# EasyEDA Pro project f1-control.eprj

# Schematic Schematic1
Create Date: 2024-01-17; Page Name: P1; Project Name: f1-control; Schematic Name: Schematic1; Update Date: 2024-01-29; Company: 嘉立创EDA; Page Size: A4; Version: V1.0
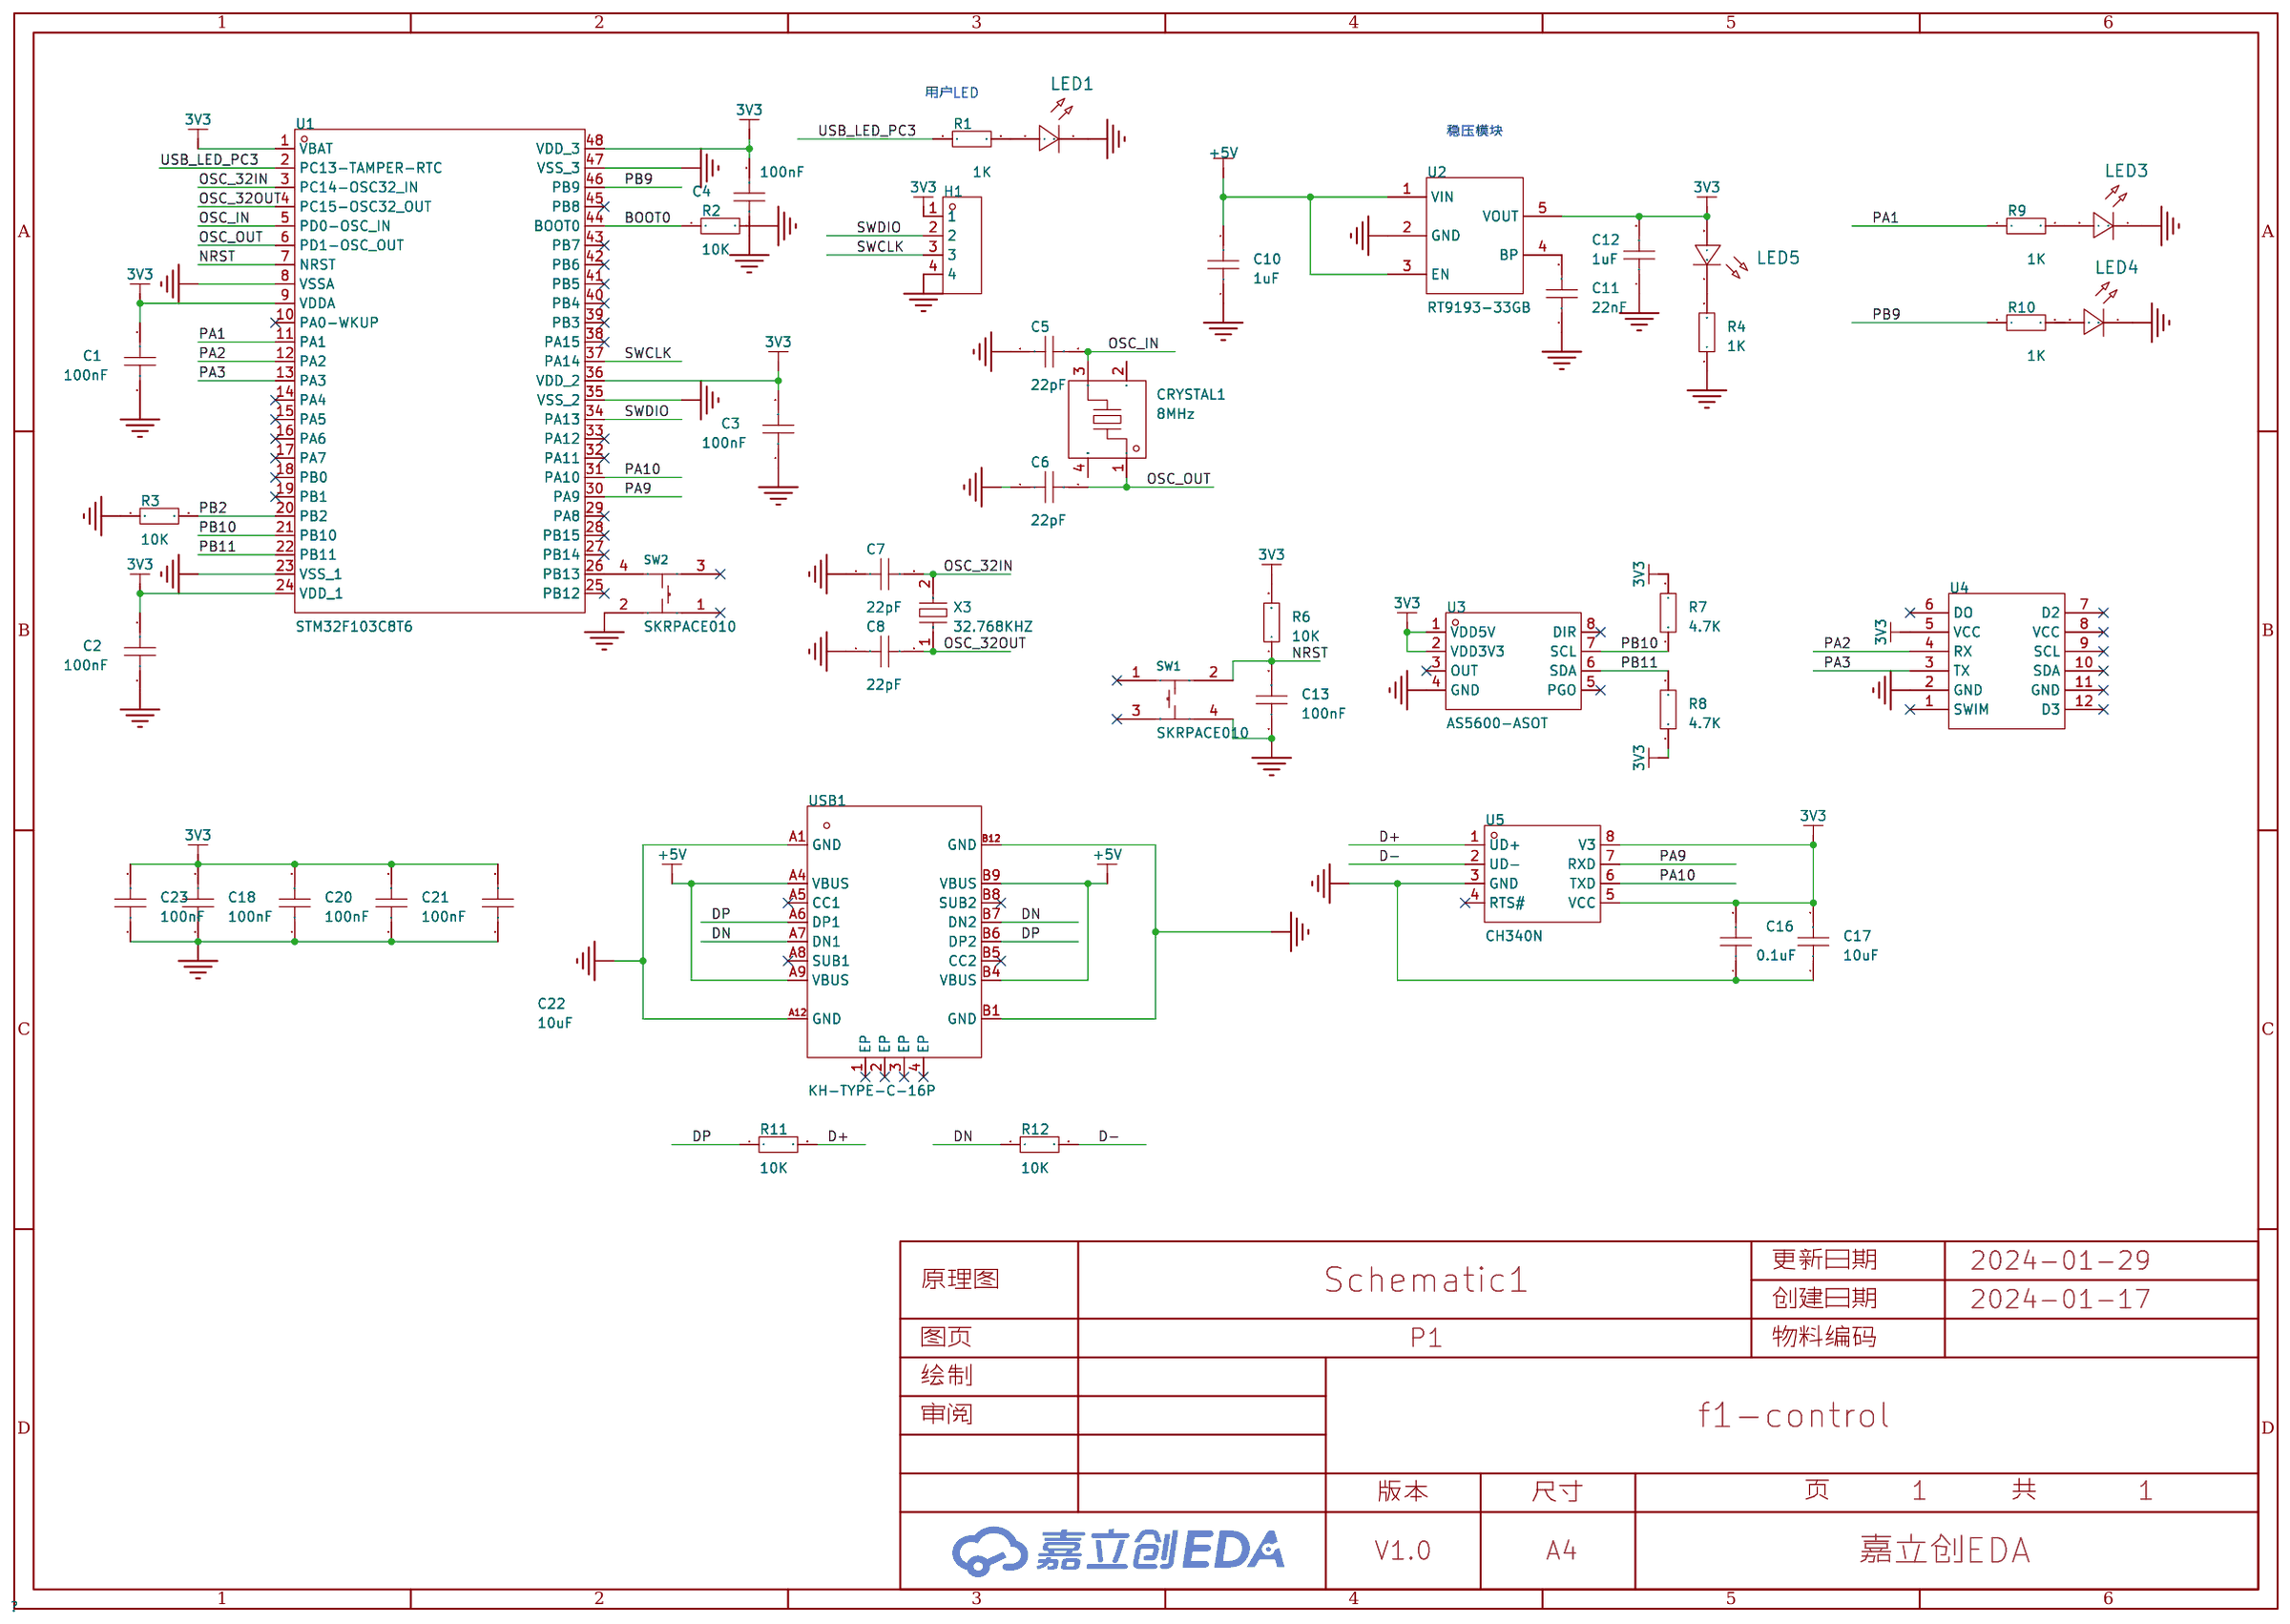
[diagram p0: schematic sheet]

## Parts
C1  100nF  [C0603]
C2  100nF  [C0603]
C3  100nF  [C0603]
C4  100nF  [C0603]
C5  22pF  [C0603]
C6  22pF  [C0603]
C7  22pF  [C0603]
C8  22pF  [C0603]
C10  1uF  [C0603]
C11  22nF  [C0603]
C12  1uF  [C0603]
C13  100nF  [C0603]
C16  0.1uF  [C0603]
C17  10uF  [C0603]
C18  100nF  [C0603]
C20  100nF  [C0603]
C21  100nF  [C0603]
C22  10uF  [C0603]
C23  100nF  [C0603]
CRYSTAL1  8MHz  [CRYSTAL-SMD_4P-L3.2-W2.5-BL_SIT8008BI]
H1  -  [HDR-TH_4P-P2.54-V-F]
LED1  -  [LED_0603]
LED3  -  [LED_0603]
LED4  -  [LED_0603]
LED5  -  [LED_0603]
R1  1K  [R0603]
R2  10K  [R0603]
R3  10K  [R0603]
R4  1K  [R0603]
R6  10K  [R0603]
R7  4.7K  [R0603]
R8  4.7K  [R0603]
R9  1K  [R0603]
R10  1K  [R0603]
R11  10K  [R0603]
R12  10K  [R0603]
SW1  SKRPACE010  [KEY-SMD_4P-L4.2-W3.2-P2.20-LS4.6]
SW2  SKRPACE010  [KEY-SMD_4P-L4.2-W3.2-P2.20-LS4.6]
U1  STM32F103C8T6  [LQFP-48_L7.0-W7.0-P0.50-LS9.0-BL]
U2  RT9193-33GB  [SOT-23-5_L3.0-W1.7-P0.95-LS2.8-BL]
U3  AS5600-ASOT  [SOIC-8_L5.0-W4.0-P1.27-LS6.0-BL]
U4  -  [WT901BC_TYL]
U5  CH340N  [SOP-8_L5.0-W4.0-P1.27-LS6.0-BL]
USB1  KH-TYPE-C-16P  [USB-C-SMD_KH-TYPE-C-16P]
X3  32.768KHZ  [CRYSTAL-SMD_L3.2-W1.5-1]

## Library data of the parts
C1-C8 C10-C13 C16-C18 C20-C23 = CAP_0603: Supplier Footprint: 0603
CRYSTAL1 = CF4008M00012001: 晶振类型:贴片晶振;频率:8MHz;常温频差:±10ppm;外接负载电容:12pF;频率稳定度(全温):±30ppm;; LCSC Part Name: 8MHz ±10ppm 12pF; Supplier Part: C7294546; Manufacturer: HUAXIN(华昕); Supplier Footprint: SMD-3225-4P; JLCPCB Part Class: 扩展库; Datasheet: https://atta.szlcsc.com/upload/public/pdf/source/20230614/403FD538918E19EFAFACD07D4A487DFF.pdf; Supplier: LCSC; Crystal Type: 贴片晶振; Normal temperature Frequency Tolerance: ±10ppm; External load capacitor: 12pF; Frequency Stability(Full temperature range): ±30ppm; Equivalent Series Resistance (ESR): 40Ω; Operating Temperature: -40℃~+85℃
H1 = HDR-F_2.54_1x4P: Supplier Part: C2718488; Supplier Footprint: 插件
LED1 LED3-LED5 = LED_0603-R: Supplier Footprint: 0603
R1-R4 R6-R12 = Res_0603: Supplier Footprint: 0603
SW1 SW2 = SKRPACE010: 触点电流:50mA;额定电压(DC):16V;电路结构:单刀单掷;安装方式:立贴;带灯:-;机械寿命:-;; LCSC Part Name: 4.2*3.2*2.5mm 立贴 轻触开关; Supplier Part: C139797; Manufacturer: ALPSALPINE(阿尔卑斯阿尔派); Supplier Footprint: SMD; JLCPCB Part Class: 扩展库; Datasheet: https://atta.szlcsc.com/upload/public/pdf/source/20171113/C139797_15105612676371115729.pdf; Supplier: LCSC; Contact Current: 50mA; Voltage Rating (DC): 16V; Circuit: 单刀单掷; Mounting Style: 立贴; Actuator Style: 椭圆形按钮; Switch Length: 4.2mm; Switch Width: 3.2mm; Switch Height: 2.5mm
U1 = STM32F103C8T6: CPU内核:ARM Cortex-M3;CPU最大主频:72MHz;工作电压范围:2V~3.6V;程序存储容量:64KB;程序存储器类型:FLASH;RAM总容量:20KB;GPIO端口数量:37;; LCSC Part Name: STM32F103C8T6 MSL=3; Supplier Part: C8734; Manufacturer: ST(意法半导体); Supplier Footprint: LQFP-48(7x7); JLCPCB Part Class: 扩展库; Datasheet: https://atta.szlcsc.com/upload/public/pdf/source/20220812/8363ACEC51AD55ECEB84799464F7CB85.pdf; Supplier: LCSC; CPU Core: ARM Cortex-M3; CPU Maximum Speed: 72MHz; Operating Voltage Range: 2V~3.6V; Program Storage Size: 64KB; Program Memory Type: FLASH; RAM Size: 20KB; GPIO Ports Number: 37; ADC (Bit): 12bit; Universal Serial Bus: 有; Peripheral/Function: 看门狗；DMA；看门狗；片载温度传感器; Watchdog: 有; Infrared Data Association: 有; Low-Voltage Detect: 有; Direct Memory Access: 有; Internal Oscillator: 有; Operating Temperature Range: -40℃~+85℃
U2 = RT9193-33GB: 输出类型:固定;最大输入电压:5.5V;输出电压:3.3V;最大输出电流:300mA;电源纹波抑制比(PSRR):70dB;输出极性:正极;; LCSC Part Name: 输入5.5V 输出3.3V 300mA; Supplier Part: C15651; Manufacturer: RICHTEK(立锜); Supplier Footprint: SOT-23-5; JLCPCB Part Class: 扩展库; Datasheet: https://atta.szlcsc.com/upload/public/pdf/source/20130730/1457706628575.pdf; Supplier: LCSC; Output Type: 固定; Maximum Input Voltage: 5.5V; Output Voltage: 3.3V; MAX Output Current: 300mA; Power Supply Rejection Ratio (PSRR): 70dB; Dropout Voltage: 300mV@(300mA); standby current: 130uA; Operating Temperature: -40℃~+125℃; Output Polarity: 正极; Number of Outputs: 1
U3 = AS5600-ASOT: Supplier Part: C499458; Manufacturer: ams(艾迈斯半导体); Supplier Footprint: SOIC-8; JLCPCB Part Class: 扩展库; Datasheet: https://atta.szlcsc.com/upload/public/pdf/source/20200324/C499458_E1461AFB0CE1042DE5756821C534625C.pdf; Supplier: LCSC
U4 = WT901BC_TYL
U5 = CH340N_C506813: 应用功能:-;接口协议:-;; LCSC Part Name: USB转串口芯片 CH340; Supplier Part: C506813; Manufacturer: WCH(南京沁恒); Supplier Footprint: SOP-8; JLCPCB Part Class: 扩展库; Datasheet: https://atta.szlcsc.com/upload/public/pdf/source/20200819/C84681_ADBED554CE321879DBD6B1D06488689C.pdf; Supplier: LCSC
USB1 = KH-TYPE-C-16P: 连接器类型:Type-C;标准:-;公母:母;端口数量:1;触点数量:16P;安装方式:卧贴;额定电流 - 电源:3A;工作温度范围:-40℃~+85℃;; LCSC Part Name: Type-C 母 卧贴; Supplier Part: C709357; Manufacturer: kinghelm(金航标); Supplier Footprint: SMD; JLCPCB Part Class: 扩展库; Datasheet: https://atta.szlcsc.com/upload/public/pdf/source/20200911/C709357_AA8DCEB38BB20E3035A7ED7AE7667837.pdf; Supplier: LCSC; Connector Type: Type-C; Gender: 母; Number of Ports: 1; Number of Contacts: 16P; Mounting Style: 卧贴; Current Rating - Power (Max): 3A; Operating Temperature Range: -40℃~+85℃
X3 = 32.768KHZ: Supplier Part: C9900023773; Supplier Footprint: FC-135; JLCPCB Part Class: 扩展库; Supplier: LCSC

## Nets
3V3: C1.2 C2.2 C3.2 C4.2 C12.2 C16.2 C17.2 C18.2 C20.2 C21.2 C22.2 C23.2 H1.1 LED5.2(A) R6.2 R7.2 R8.2 U1.1(VBAT) U1.9(VDDA) U1.24(VDD_1) U1.36(VDD_2) U1.48(VDD_3) U2.5(VOUT) U3.1(VDD5V) U3.2(VDD3V3) U4.5(VCC) U5.5(VCC) U5.8(V3)
+5V: C10.2 U2.1(VIN) U2.3(EN) USB1.A4(VBUS) USB1.A9(VBUS) USB1.B4(VBUS) USB1.B9(VBUS)
GND: C1.1 C2.1 C3.1 C4.1 C5.1 C6.1 C7.1 C8.1 C10.1 C11.1 C12.1 C13.1 C16.1 C17.1 C18.1 C20.1 C21.1 C22.1 C23.1 H1.4 LED1.1(C) LED3.1(C) LED4.1(C) R2.2 R3.1 R4.1 SW1.4 SW2.2 U1.8(VSSA) U1.23(VSS_1) U1.35(VSS_2) U1.47(VSS_3) U2.2(GND) U3.4(GND) U4.2(GND) U5.3(GND) USB1.A1(GND) USB1.A12(GND) USB1.B1(GND) USB1.B12(GND)
BOOT0: R2.1 U1.44(BOOT0)
D+: R11.2 U5.1(UD+)
D-: R12.2 U5.2(UD-)
DN: R12.1 USB1.A7(DN1) USB1.B7(DN2)
DP: R11.1 USB1.A6(DP1) USB1.B6(DP2)
NRST: C13.2 R6.1 SW1.2 U1.7(NRST)
OSC_32IN: C7.2 U1.3(PC14-OSC32_IN) X3.2
OSC_32OUT: C8.2 U1.4(PC15-OSC32_OUT) X3.1
OSC_IN: C5.2 CRYSTAL1.3 U1.5(PD0-OSC_IN)
OSC_OUT: C6.2 CRYSTAL1.1 U1.6(PD1-OSC_OUT)
PA1: R9.1 U1.11(PA1)
PA2: U1.12(PA2) U4.4(RX)
PA3: U1.13(PA3) U4.3(TX)
PA9: U1.30(PA9) U5.7(RXD)
PA10: U1.31(PA10) U5.6(TXD)
PB2: R3.2 U1.20(PB2)
PB9: R10.1 U1.46(PB9)
PB10: R7.1 U1.21(PB10) U3.7(SCL)
PB11: R8.1 U1.22(PB11) U3.6(SDA)
SWCLK: H1.3 U1.37(PA14)
SWDIO: H1.2 U1.34(PA13)
USB_LED_PC3: R1.1 U1.2(PC13-TAMPER-RTC)
$1N1732: LED1.2(A) R1.2
$1N3021: C11.2 U2.4(BP)
$1N5075: LED3.2(A) R9.2
$1N5141: LED4.2(A) R10.2
$1N7516: LED5.1(C) R4.2
$1N8886: SW2.4 U1.26(PB13)

Not connected (* = marked no-connect by the designer): CRYSTAL1 2(GND) 4(GND); SW1 1* 3*; SW2 1* 3*; U1 10(PA0-WKUP)* 14(PA4)* 15(PA5)* 16(PA6)* 17(PA7)* 18(PB0)* 19(PB1)* 25(PB12)* 27(PB14)* 28(PB15)* 29(PA8)* 32(PA11)* 33(PA12)* 38(PA15)* 39(PB3)* 40(PB4)* 41(PB5)* 42(PB6)* 43(PB7)* 45(PB8)*; U3 3(OUT)* 5(PGO)* 8(DIR)*; U4 1(SWIM)* 6(DO)* 7(D2)* 8(VCC)* 9(SCL)* 10(SDA)* 11(GND)* 12(D3)*; U5 4(RTS#)*; USB1 1(EP)* 2(EP)* 3(EP)* 4(EP)* A5(CC1)* A8(SUB1)* B5(CC2)* B8(SUB2)*

## Notes on the sheet
- 用户LED
- 稳压模块

# Board PCB3
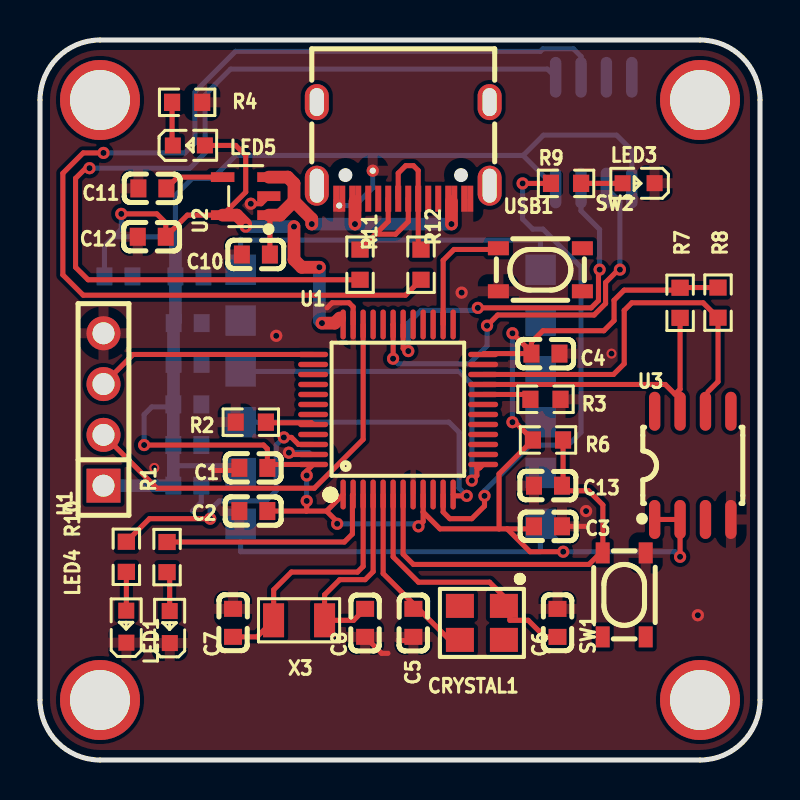
[diagram p1: board, top side]
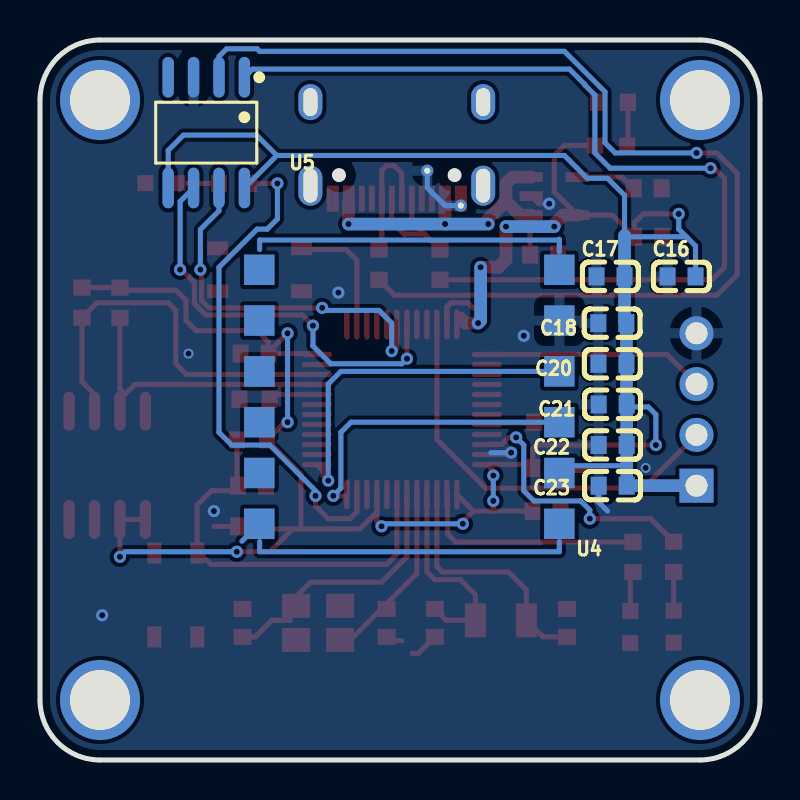
[diagram p2: board, bottom side, seen from below]

Outline 36 x 36 mm; copper layers: Top Layer, Bottom Layer. Coordinates in mm from the lower left corner of the outline.
Outline path: 0,33 arc(0.88,35.12) 3,36 33,36 arc(35.12,35.12) 36,33 36,3 arc(35.12,0.88) 33,0 3,0 arc(0.88,0.88) 0,3 0,33
Stack: Top Layer 0.035mm / Dielectric1 1.51mm FR4 er 4.5 / Bottom Layer 0.035mm

## Design rules (mm)
template: JLCPCB Capability(Two Layers Board)
spacing copperThickness1oz (default): track to track 0.102, other pairs 0.152 to 0.3
spacing copperThickness2oz: track to track 0.203, other pairs 0.152 to 0.3
track width copperThickness1oz (default): min 0.127, default 0.254, max 2.54
track width copperThickness2oz: min 0.203, default 0.254, max 2.54
differential pair differentialPair (default): width min 0.127, default 0.254, max 2.54; gap min 0.152, default 0.152
via viaSize (default): diameter min 0.5, default 0.61, max 10; hole min 0.3, default 0.305, max 6.3

## Placement (name value [footprint] x y rotation side)
C1  100nF  [C0603]  10.67 14.61 0 top
C2  100nF  [C0603]  10.67 12.45 0 top
C3  100nF  [C0603]  25.4 11.68 180 top
C4  100nF  [C0603]  25.27 20.32 180 top
C5  22pF  [C0603]  18.67 6.86 90 top
C6  22pF  [C0603]  25.87 6.86 270 top
C7  22pF  [C0603]  9.65 6.86 270 top
C8  22pF  [C0603]  16.26 6.86 90 top
C10  1uF  [C0603]  10.79 25.27 0 top
C11  22nF  [C0603]  5.62 28.58 0 top
C12  1uF  [C0603]  5.59 26.16 0 top
C13  100nF  [C0603]  25.4 13.72 0 top
C16  0.1uF  [C0603]  3.92 24.18 180 bottom
C17  10uF  [C0603]  7.47 24.18 180 bottom
C18  100nF  [C0603]  7.38 21.84 180 bottom
C20  100nF  [C0603]  7.38 19.81 180 bottom
C21  100nF  [C0603]  7.37 17.78 180 bottom
C22  10uF  [C0603]  7.37 15.75 180 bottom
C23  100nF  [C0603]  7.37 13.72 180 bottom
CRYSTAL1  8MHz  [CRYSTAL-SMD_4P-L3.2-W2.5-BL_SIT8008BI]  22.09 6.86 180 top
H1  -  [HDR-TH_4P-P2.54-V-F]  3.18 17.53 90 top
LED1  -  [LED_0603]  6.48 6.7 90 top
LED3  -  [LED_0603]  29.88 28.83 180 top
LED4  -  [LED_0603]  4.31 6.72 90 top
LED5  -  [LED_0603]  7.49 30.73 0 top
NOREF  -  [Pad_e1399]  14.96 27.72 0 top
NOREF#2  -  [Pad_e52]  33 33 0 top
NOREF#3  -  [Pad_e50]  33 3 0 top
NOREF#4  -  [Pad_e1391]  16.64 29.46 0 top
NOREF#5  -  [Pad_e53]  3 33 0 top
NOREF#6  -  [Pad_e54]  3 3 0 top
R1  1K  [R0603]  6.35 10.15 270 top
R2  10K  [R0603]  10.54 16.89 180 top
R3  10K  [R0603]  25.27 18.03 180 top
R4  1K  [R0603]  7.36 32.88 180 top
R6  10K  [R0603]  25.4 16 180 top
R7  4.7K  [R0603]  32 22.86 90 top
R8  4.7K  [R0603]  33.9 22.87 90 top
R9  1K  [R0603]  26.3 28.83 0 top
R10  1K  [R0603]  4.32 10.16 270 top
R11  10K  [R0603]  16 24.77 270 top
R12  10K  [R0603]  19.05 24.77 270 top
SW1  SKRPACE010  [KEY-SMD_4P-L4.2-W3.2-P2.20-LS4.6]  29.21 8.25 90 top
SW2  SKRPACE010  [KEY-SMD_4P-L4.2-W3.2-P2.20-LS4.6]  25.02 24.51 180 top
U1  STM32F103C8T6  [LQFP-48_L7.0-W7.0-P0.50-LS9.0-BL]  17.91 17.53 0 top
U2  RT9193-33GB  [SOT-23-5_L3.0-W1.7-P0.95-LS2.8-BL]  10.29 28.19 90 top
U3  AS5600-ASOT  [SOIC-8_L5.0-W4.0-P1.27-LS6.0-BL]  32.64 14.73 0 top
U4  -  [WT901BC_TYL]  10.03 24.51 0 bottom
U5  CH340N  [SOP-8_L5.0-W4.0-P1.27-LS6.0-BL]  27.69 31.37 0 bottom
USB1  KH-TYPE-C-16P  [USB-C-SMD_KH-TYPE-C-16P]  18.16 30.48 180 top
X3  32.768KHZ  [CRYSTAL-SMD_L3.2-W1.5-1]  12.95 6.98 180 top

## Footprints (pads in the part's own frame, mm; a bottom-side part is the same pattern mirrored in y, then rotated)
C0603
  rect 0.8x0.9 smd: 1(-0.7,0) 2(0.7,0)
CRYSTAL-SMD_4P-L3.2-W2.5-BL_SIT8008BI
  rect 1.4x1.2 smd: 1(-1.1,-0.85) 2(1.1,-0.85) 3(1.1,0.85) 4(-1.1,0.85)
CRYSTAL-SMD_L3.2-W1.5-1
  rect 1.05x1.7 smd: 1(-1.275,0) 2(1.275,0)
HDR-TH_4P-P2.54-V-F
  rect 1.7x1.7 hole 1.1: 1(-3.81,0)
  round 1.7 hole 1.1: 2(-1.27,0) 3(1.27,0) 4(3.81,0)
KEY-SMD_4P-L4.2-W3.2-P2.20-LS4.6
  rect 1.05x0.7 smd: 1(-2.1,1.075) 2(2.1,1.075) 3(-2.1,-1.075) 4(2.1,-1.075)
LED_0603
  rect 0.8x0.8 smd: 1(-0.851,-0.01) 2(0.75,-0.005)
LQFP-48_L7.0-W7.0-P0.50-LS9.0-BL
  oval 0.27x1.5 smd: 1(-2.75,-4.25) 2(-2.25,-4.25) 3(-1.75,-4.25) 4(-1.25,-4.25) 5(-0.75,-4.25) 6(-0.25,-4.25) 7(0.25,-4.25) 8(0.75,-4.25) 9(1.25,-4.25) 10(1.75,-4.25) 11(2.25,-4.25) 12(2.75,-4.25) 25(2.75,4.25) 26(2.25,4.25) 27(1.75,4.25) 28(1.25,4.25) 29(0.75,4.25) 30(0.25,4.25) 31(-0.25,4.25) 32(-0.75,4.25) 33(-1.25,4.25) 34(-1.75,4.25) 35(-2.25,4.25) 36(-2.75,4.25)
  oval 1.5x0.27 smd: 13(4.25,-2.75) 14(4.25,-2.25) 15(4.25,-1.75) 16(4.25,-1.25) 17(4.25,-0.75) 18(4.25,-0.25) 19(4.25,0.25) 20(4.25,0.75) 21(4.25,1.25) 22(4.25,1.75) 23(4.25,2.25) 24(4.25,2.75) 37(-4.25,2.75) 38(-4.25,2.25) 39(-4.25,1.75) 40(-4.25,1.25) 41(-4.25,0.75) 42(-4.25,0.25) 43(-4.25,-0.25) 44(-4.25,-0.75) 45(-4.25,-1.25) 46(-4.25,-1.75) 47(-4.25,-2.25) 48(-4.25,-2.75)
Pad_e50
  round 4 hole 3: 49(0,0)
Pad_e52
  round 4 hole 3: 50(0,0)
Pad_e53
  round 4 hole 3: 51(0,0)
Pad_e54
  round 4 hole 3: 52(0,0)
Pad_e1391
  round 0.61 hole 0.305: 53(0,0)
Pad_e1399
  round 0.61 hole 0.305: 54(0,0)
R0603
  rect 0.806x0.864 smd: 1(-0.753,0) 2(0.753,0)
SOIC-8_L5.0-W4.0-P1.27-LS6.0-BL
  oval 0.569x1.95 smd: 1(-1.905,-2.705) 2(-0.635,-2.705) 3(0.635,-2.705) 4(1.905,-2.705) 5(1.905,2.705) 6(0.635,2.705) 7(-0.635,2.705) 8(-1.905,2.705)
SOP-8_L5.0-W4.0-P1.27-LS6.0-BL
  oval 0.574x2.035 smd: 1(-1.905,-2.768) 2(-0.635,-2.768) 3(0.635,-2.768) 4(1.905,-2.768) 5(1.905,2.768) 6(0.635,2.768) 7(-0.635,2.768) 8(-1.905,2.768)
SOT-23-5_L3.0-W1.7-P0.95-LS2.8-BL
  rect 0.49x1.157 smd: 1(-0.95,-1.153) 2(0,-1.153) 3(0.95,-1.153)
  rect 0.49x1.175 smd: 4(0.95,1.153) 5(-0.95,1.153)
USB-C-SMD_KH-TYPE-C-16P
  oval 1.2x2 hole 0.7x1.7: 1(-4.32,1.765) 2(4.32,1.765)
  oval 1.2x1.8 hole 0.7x1.4: 3(-4.32,-2.415) 4(4.32,-2.415)
  rect 0.3x1.3 smd: A1(-3.35,2.415) A4(-2.55,2.415) A5(-1.25,2.415) A6(-0.25,2.415) A7(0.25,2.415) A8(1.25,2.415) A9(2.55,2.415) A12(3.35,2.415) B1(3.05,2.415) B4(2.25,2.415) B5(1.75,2.415) B6(0.75,2.415) B7(-0.75,2.415) B8(-1.75,2.415) B9(-2.25,2.415) B12(-3.05,2.415)
WT901BC_TYL
  rect 1.524x1.524 smd: 1(0,0) 2(0,2.54) 3(0,5.08) 4(0,7.62) 5(0,10.16) 6(0,12.7) 7(15,12.7) 8(15,10.16) 9(15,7.62) 10(15,5.08) 11(15,2.54) 12(15,0)

## Nets
As in the schematic, except:
GND: C1.1 C2.1 C3.1 C4.1 C5.1 C6.1 C7.1 C8.1 C10.1 C11.1 C12.1 C13.1 C16.1 C17.1 C18.1 C20.1 C21.1 C22.1 C23.1 H1.4 LED1.1 LED3.1 LED4.1 NOREF.54 NOREF#4.53 R2.2 R3.1 R4.1 SW1.4 SW2.2 U1.8 U1.23 U1.35 U1.47 U2.2 U3.4 U4.2 U5.3 USB1.A1 USB1.A12 USB1.B1 USB1.B12

Pads without a net: CRYSTAL1 2 4; NOREF#2 50; NOREF#3 49; NOREF#5 51; NOREF#6 52; SW1 1 3; SW2 1 3; U1 10 14 15 16 17 18 19 25 27 28 29 32 33 38 39 40 41 42 43 45; U3 3 5 8; U4 1 6 7 8 9 10 11 12; U5 4; USB1 1 2 3 4 A5 A8 B5 B8

## Via types
v1: diameter 0.61, hole 0.305, Top Layer to Bottom Layer, 37 vias
v2: diameter 0.5, hole 0.3, Top Layer to Bottom Layer, 2 vias

## Routing (per net, layer and track width the routed paths; a pad name or vN(x,y) marks a point on that pad's centre or on a via; arc(x,y) is an arc through that point)
3V3: length 150.2
  Top Layer w0.254: v1(23.62,16.89) 23.76,16.89 R6.2 22.95,14.31 22.95,11.56 ; 22.95,11.56 20,11.56 19.16,12.4 ; 22.95,11.56 23.36,11.56 ; v1(26.16,10.41) 24.5,10.41 23.36,11.56 ; v1(5.21,15.75) 11.18,15.75 11.37,15.56 C1.2 11.54,14.78 U1.48 13.34,14.45 v1(13.34,14.22) ; 13.31,12.45 13.34,12.47 v1(13.34,12.95) ; 13.31,12.45 C2.2 ; 13.31,12.45 14.33,12.45 ; C3.2 24.57,11.56 23.36,11.56 ; 14.33,12.45 14.86,11.91 v1(14.86,11.81) ; 14.33,12.45 U1.1 ; LED5.2 9.78,30.73 10.29,30.23 10.29,28.4 U2.5 7.37,27.24 C12.2 6.29,26.86 5.84,27.31 v1(4.06,27.31) ; U3.1 U3.2 v1(32,10.16) ; v1(18.92,11.68) 19.16,11.92 19.16,12.4 ; 19.16,12.4 U1.9 ; R8.2 32.01,23.62 R7.2 31.89,23.5 29.21,23.5 28.7,22.99 28.7,21.97 28.19,21.46 25.15,21.46 24.57,20.89 24.57,20.39 ; v1(23.62,21.34) 24.57,20.39 ; 24.57,20.39 C4.2 22.2,20.32 U1.24
  Top Layer w0.635: 10.29,26.8 9.84,27.24 U2.5 ; v1(12.7,26.67) 12.7,25.02 13.08,24.64 v1(13.97,24.64) ; v1(14.1,21.84) 14.73,21.84 14.99,22.1
  Bottom Layer w0.254: v1(14.86,11.81) 18.8,11.81 v1(18.92,11.68) ; C16.2 3.22,25.7 3.68,26.16 ; v1(13.34,14.22) v1(13.34,12.95) ; 3.68,26.16 4.06,26.54 v1(4.06,27.31) ; 3.68,26.16 6.71,26.16 6.77,26.23 6.77,28.24 7.62,29.08 8.64,29.08 9.78,30.23 24.16,30.23 ; 6.67,14.71 9.67,14.71 U4.5 ; C21.2 6.54,17.65 5.59,17.65 5.21,17.27 v1(5.21,15.75) ; v1(26.16,10.41) 31.75,10.41 v1(32,10.16) ; U5.5 29.59,30.48 28.83,31.24 25.17,31.24 24.16,30.23 ; 24.16,30.23 U5.8 ; v1(23.62,16.89) v1(23.62,21.34)
  Bottom Layer w0.635: 6.77,26.23 6.77,21.93 C18.2 6.68,21.83 6.68,17.79 C21.2 C22.2 C23.2 H1.1 ; v1(13.97,24.64) 13.97,21.97 v1(14.1,21.84) ; v1(10.29,26.67) v1(12.7,26.67)
+5V: length 16.9
  Top Layer w0.254: USB1.A9 USB1.B4 ; 11.5,25.27 11.5,27.19 U2.1
  Top Layer w0.635: 15.75,27.93 v1(15.75,26.8) ; 12.7,27.94 12.7,28.83 12.38,29.14 U2.3 ; 12.7,27.94 13.59,27.05 v1(13.59,26.8) ; 12.7,27.94 12,27.24 U2.1 ; 20.57,27.93 v1(20.57,26.8)
  Bottom Layer w0.635: v1(20.57,26.8) v1(15.75,26.8) v1(13.59,26.8)
GND: length 15.1
  Top Layer w0.254: U1.47 12.54,15.28 v1(12.45,15.37) ; 14.35,22.61 14.6,22.86 15.45,22.86 15.66,22.65 U1.35 ; U2.2 11.06,27.81 v1(10.54,27.81) ; C3.1 27.31,11.68 ; 17.91,5.97 18.73,5.97 18.92,6.16 ; C8.1 17.08,5.33 17.4,5.33 ; C1.1 9.84,14.48 8.64,14.48
  Bottom Layer w0.254: 16.64,29.34 16.64,28.61 15.75,27.72 NOREF.54 ; v1(12.45,15.37) 13.46,15.37 ; C23.1 8.07,12.89 7.62,12.45
  vias: v1(11.81,21.21) v1(21.08,23.37) v1(27.31,12.45) v1(32.89,7.24) v2(5.72,14.61) v2(28.57,20.32)
(no net): length 1.2
  Bottom Layer w0.254: U4.7 25.91,10.94
BOOT0: length 2.4
  Top Layer w0.254: U1.44 13.57,16.86 11.32,16.86 R2.1
D+: length 46.9
  Top Layer w0.254: 2.29,29.59 1.78,29.08 1.78,24.64 2.4,24.01 R11.2
  Bottom Layer w0.254: v1(2.47,29.59) 7.49,29.59 8.25,30.35 8.25,33.25 8.76,33.76 8.76,33.78 9.53,34.54 25.37,34.54 U5.1
D-: length 54.9
  Top Layer w0.254: R12.2 18.28,23.24 2.16,23.24 1.14,24.26 1.14,29.34 2.16,30.35 v1(3.18,30.35)
  Bottom Layer w0.254: v1(3.18,30.35) 7.24,30.35 7.75,30.86 7.75,33.4 9.78,35.43 25.02,35.43 25.15,35.56 26.67,35.56 27.05,35.18 U5.2
DN: length 6.5
  Top Layer w0.254: R12.1 18.91,25.66 USB1.B7 18.91,29.48 18.67,29.72 18.29,29.72 17.91,29.34 USB1.A7
DP: length 6.2
  Top Layer w0.254: 16.77,26.29 17.78,26.29 18.41,26.92 18.41,28.06 USB1.A6 ; 16.77,26.29 17.41,26.93 USB1.B6 ; 16.77,26.29 R11.1
NRST: length 20.5
  Top Layer w0.254: U1.7 18.16,10.29 18.67,9.78 27.45,9.78 28.14,10.47 28.14,12.75 27.43,13.46 26.35,13.46 C13.2 26.15,13.77 R6.1
OSC_32IN: length 12.4
  Top Layer w0.254: U1.3 16.16,9.68 15.88,9.4 12.57,9.4 11.68,8.51 11.68,6.99 X3.2 10.85,6.16 C7.2
OSC_32OUT: length 10.3
  Top Layer w0.254: C8.2 15.68,6.98 X3.1 14.23,8.26 14.99,9.02 16.26,9.02 16.66,9.42 U1.4
OSC_IN: length 9.2
  Top Layer w0.254: U1.5 17.16,9.32 20.48,6.01 20.99,6.01
OSC_OUT: length 13.5
  Top Layer w0.254: U1.6 17.66,10.16 18.92,8.89 22.48,8.89 23.19,8.17 CRYSTAL1.1 23.5,7.41 23.5,6.98 24.41,6.98 25.24,6.16 C6.2
PA1: length 25.5
  Top Layer w0.254: v1(22.22,13.21) 22.22,12.7 21.59,12.06 20.49,12.06 20.16,12.4 U1.11 ; v1(24.13,28.83) 25.55,28.83 R9.1
  Bottom Layer w0.254: v1(22.22,13.21) 22.22,13.46 24.51,15.75 26.42,15.75 27.05,16.38 27.05,24.64 25.15,26.54 24.64,26.54 24.13,27.05 v1(24.13,28.83)
PA2: length 15.2
  Top Layer w0.254: v1(21.34,13.21) 20.72,13.21 U1.12
  Bottom Layer w0.254: v1(21.34,13.21) 20.96,13.59 20.96,16.38 20.45,16.89 10.03,16.89
PA3: length 17.8
  Top Layer w0.254: U1.13 21.99,14.61 21.84,14.61 21.84,14.22 v1(21.59,13.97)
  Bottom Layer w0.254: v1(21.59,13.97) 21.59,18.8 20.96,19.43 U4.3
PA9: length 18.6
  Top Layer w0.254: 18.29,20.45 18.16,20.58 U1.30 ; v1(21.89,22.61) 27.56,22.61 27.92,22.97 27.92,24.37
  Bottom Layer w0.254: U5.7 27.05,27.46 27.98,26.53 v1(27.98,24.52) ; v1(21.89,22.61) 21.76,22.48 19.05,22.48 18.41,21.84 v1(18.41,20.45)
PA10: length 20.6
  Top Layer w0.254: v1(22.35,21.72) 22.88,22.25 27.71,22.25 28.28,22.82 28.28,23.88 28.91,24.51 28.96,24.51 ; v1(17.65,20.07) 17.66,20.07 U1.31 17.65,21.77
  Bottom Layer w0.254: v1(22.35,21.72) 22.35,20.7 21.46,19.81 17.91,19.81 v1(17.65,20.07) ; U5.6 29,27.93 v1(29,24.52)
PB2: length 2.5
  Top Layer w0.254: R3.2 24.28,18.28 U1.20
PB9: length 13.2
  Top Layer w0.254: v1(12.19,16.13) 12.57,16.13 12.93,15.78 U1.46 ; R10.1 5.47,12.06 v1(8.51,12.06)
  Bottom Layer w0.254: v1(12.19,16.13) 11.81,15.75 11.81,13.46 11.3,12.95 8.97,12.95 8.51,12.5 v1(8.51,12.06)
PB10: length 13.7
  Top Layer w0.254: U1.21 31.26,18.78 31.75,18.29 32,18.54 R7.1
PB11: length 19
  Top Layer w0.254: U1.22 28.67,19.28 29.21,19.81 29.21,22.48 29.59,22.86 33.16,22.86 R8.1 33.9,18.91 33.4,18.42
SWCLK: length 11.1
  Top Layer w0.254: H1.3 4.66,20.28 U1.37
SWDIO: length 20.8
  Top Layer w0.254: U1.34 16.16,16.03 13.72,13.59 5.84,13.59 H1.2
USB_LED_PC3: length 11.4
  Top Layer w0.254: U1.2 15.62,13.24 15.62,11.3 15.22,10.9 R1.1
$1N1732: length 2
  Top Layer w0.254: R1.2 6.48,9.26 6.48,7.45
$1N3021: length 3
  Top Layer w0.254: U2.4 6.88,29.14 C11.2
$1N5075: length 2.1
  Top Layer w0.254: R9.2 29.12,28.83 29.13,28.84
$1N5141: length 1.9
  Top Layer w0.254: LED4.2 4.32,7.47 R10.2
$1N7516: length 2.2
  Top Layer w0.254: R4.2 6.6,30.76 LED5.1
$1N8886: length 6.2
  Top Layer w0.254: SW2.4 22.86,25.53 20.7,25.53 20.16,24.98 U1.26

## Copper pours and planes (outline as drawn; the poured copper is in the pictures)
GND on Top Layer: -3.56,38.23 39.75,38.23 39.75,-2.67 -3.56,-2.67
GND on Bottom Layer: -8.25,40.89 45.33,40.89 45.33,-6.35 -8.25,-6.35
